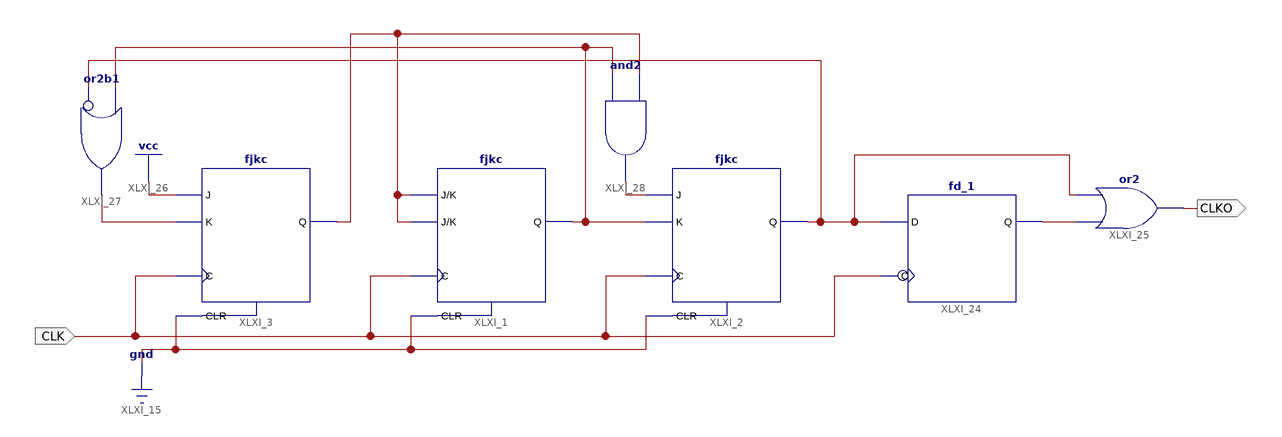
[diagram p0: schematic sheet 1]
// Xilinx ISE schematic clkdiv7.sch (spartan6) as structural Verilog: 7 symbols, 2 ports
module clkdiv7 (
  input  CLK,
  output CLKO
);

  wire XLXN_38, XLXN_39, XLXN_41, XLXN_44, XLXN_45, XLXN_49;

  fjkc XLXI_2 (.C(CLK), .CLR(1'b0), .J(XLXN_49), .K(XLXN_41), .Q(XLXN_39));
  fjkc XLXI_3 (.C(CLK), .CLR(1'b0), .J(1'b1), .K(XLXN_44), .Q(XLXN_45));
  fd_1 XLXI_24 (.C(CLK), .D(XLXN_39), .Q(XLXN_38));
  or XLXI_25 (CLKO, XLXN_38, XLXN_39);
  fjkc XLXI_1 (.C(CLK), .CLR(1'b0), .J(XLXN_45), .K(XLXN_45), .Q(XLXN_41));
  or XLXI_27 (XLXN_44, ~XLXN_39, XLXN_41);  // or2b1
  and XLXI_28 (XLXN_49, XLXN_41, XLXN_45);
endmodule
